# Altium schematic sheet LO.SchDoc
size A; SheetNumber: 4; SheetTotal: 11
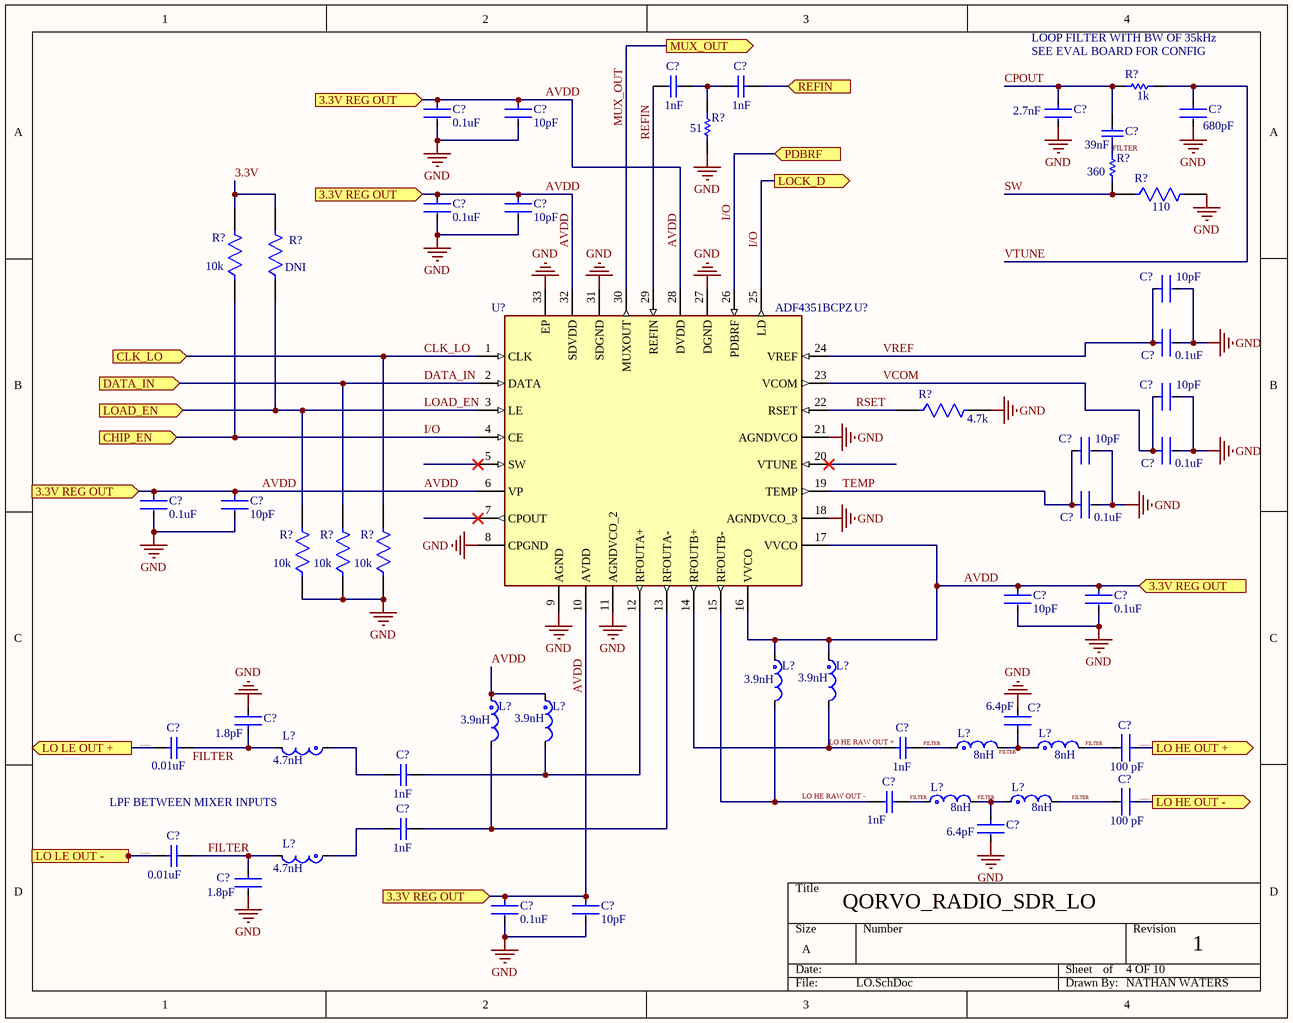
[diagram p0: LO.SchDoc]

## Parts
(Parts that share a designator on the sheet are numbered #1, #2 ... from top to bottom, then left to right.)
C?#1  Capacitance: 1nF  [CAPC2013X145X48LL20T23]  (hidden comment: VJ0805D102KXAAJ)
C?#2  Capacitance: 1nF  [CAPC2013X145X48LL20T23]  (hidden comment: VJ0805D102KXAAJ)
C?#3  Capacitance: 0.1uF  [FP-GRM155-0_05-MFG]  (hidden comment: GRM155R71C104KA88J)
C?#4  Capacitance: 10pF  [FP-GJM155-0_05-IPC_A]  (hidden comment: GJM1555C1H100JB01D)
C?#5  Capacitance: 2.7nF  [FP-GRM033-0_03-MFG]  (hidden comment: GRM033R71C272KA88D)
C?#6  Capacitance: 680pF  [FP-GCM155-0_05-IPC_A]  (hidden comment: GCM1555C1H681JA16D)
C?#7  INDUCTANCE: 39nF  [CAPC1005X55X25ML05T10]  (hidden comment: GRM155R71C393KA01D)
C?#8  Capacitance: 0.1uF  [FP-GRM155-0_05-MFG]  (hidden comment: GRM155R71C104KA88J)
C?#9  Capacitance: 10pF  [FP-GJM155-0_05-IPC_A]  (hidden comment: GJM1555C1H100JB01D)
C?#10  Capacitance: 10pF  [FP-GJM155-0_05-IPC_A]  (hidden comment: GJM1555C1H100JB01D)
C?#11  Capacitance: 0.1uF  [FP-GRM155-0_05-MFG]  (hidden comment: GRM155R71C104KA88J)
C?#12  Capacitance: 10pF  [FP-GJM155-0_05-IPC_A]  (hidden comment: GJM1555C1H100JB01D)
C?#13  Capacitance: 10pF  [FP-GJM155-0_05-IPC_A]  (hidden comment: GJM1555C1H100JB01D)
C?#14  Capacitance: 0.1uF  [FP-GRM155-0_05-MFG]  (hidden comment: GRM155R71C104KA88J)
C?#15  Capacitance: 0.1uF  [FP-GRM155-0_05-MFG]  (hidden comment: GRM155R71C104KA88J)
C?#16  Capacitance: 10pF  [FP-GJM155-0_05-IPC_A]  (hidden comment: GJM1555C1H100JB01D)
C?#17  Capacitance: 0.1uF  [FP-GRM155-0_05-MFG]  (hidden comment: GRM155R71C104KA88J)
C?#18  Capacitance: 10pF  [FP-GJM155-0_05-IPC_A]  (hidden comment: GJM1555C1H100JB01D)
C?#19  Capacitance: 0.1uF  [FP-GRM155-0_05-MFG]  (hidden comment: GRM155R71C104KA88J)
C?#20  Capacitance: 1.8pF  [FP-GJM155-0_05-MFG]  (hidden comment: GJM1555C1H1R8CB01D)
C?#21  CAPACITANCE: 1nF  [CAPC2013X145X48LL20T23]  (hidden comment: VJ0805D102KXAAJ)
C?#22  Capacitance: 6.4pF  [FP-GJM155-0_05-IPC_C]  (hidden comment: GJM1555C1H6R4BB01D)
C?#23  Capacitance: 0.01uF  [CAPC1005X55X25LL05T10]  (hidden comment: GRM155R71C103KA01D)
C?#24  value 100 pF  [FP-CBR04C-MFG]  (hidden comment: CBR04C101F3GAC)
C?#25  CAPACITANCE: 1nF  [CAPC2013X145X48LL20T23]  (hidden comment: VJ0805D102KXAAJ)
C?#26  CAPACITANCE: 1nF  [CAPC2013X145X48LL20T23]  (hidden comment: VJ0805D102KXAAJ)
C?#27  value 100 pF  [FP-CBR04C-MFG]  (hidden comment: CBR04C101F3GAC)
C?#28  CAPACITANCE: 1nF  [CAPC2013X145X48LL20T23]  (hidden comment: VJ0805D102KXAAJ)
C?#29  Capacitance: 6.4pF  [FP-GJM155-0_05-IPC_C]  (hidden comment: GJM1555C1H6R4BB01D)
C?#30  Capacitance: 0.01uF  [CAPC1005X55X25LL05T10]  (hidden comment: GRM155R71C103KA01D)
C?#31  Capacitance: 1.8pF  [FP-GJM155-0_05-MFG]  (hidden comment: GJM1555C1H1R8CB01D)
C?#32  Capacitance: 0.1uF  [FP-GRM155-0_05-MFG]  (hidden comment: GRM155R71C104KA88J)
C?#33  Capacitance: 10pF  [FP-GJM155-0_05-IPC_A]  (hidden comment: GJM1555C1H100JB01D)
L?#1  INDUCTANCE: 3.9nH  [FP-LQG15HH_02-MFG]  (hidden comment: LQG15HN3N9B02D)
L?#2  INDUCTANCE: 3.9nH  [FP-LQG15HH_02-MFG]  (hidden comment: LQG15HN3N9B02D)
L?#3  INDUCTANCE: 3.9nH  [FP-LQG15HH_02-MFG]  (hidden comment: LQG15HN3N9B02D)
L?#4  INDUCTANCE: 3.9nH  [FP-LQG15HH_02-MFG]  (hidden comment: LQG15HN3N9B02D)
L?#5  INDUCTANCE: 4.7nH  [FP-LQG15HH_02-IPC_B]  (hidden comment: LQG15HN4N7B02D)
L?#6  INDUCTANCE: 8nH  [0402 CAP_INDUCTOR]  (hidden comment: ATFC-0402-8N0B-T)
L?#7  INDUCTANCE: 8nH  [0402 CAP_INDUCTOR]  (hidden comment: ATFC-0402-8N0B-T)
L?#8  INDUCTANCE: 8nH  [0402 CAP_INDUCTOR]  (hidden comment: ATFC-0402-8N0B-T)
L?#9  INDUCTANCE: 8nH  [0402 CAP_INDUCTOR]  (hidden comment: ATFC-0402-8N0B-T)
L?#10  INDUCTANCE: 4.7nH  [FP-LQG15HH_02-IPC_B]  (hidden comment: LQG15HN4N7B02D)
R?#1  RESISTANCE: 1k  [RESC1005X40X25LL05T10]  (hidden comment: RC0402JR-071KL)
R?#2  Resistance: 51  [RESC1005X40X25NL05T05]  (hidden comment: CRCW040251R0FKED)
R?#3  Resistance: 360  [RESC1005X40X25LL05T05]  (hidden comment: RMCF1206JT360R)
R?#4  Resistance: 110  [FP-CRCW0402-e3-IPC_A]  (hidden comment: CRCW0402110RFKED)
R?#5  Resistance: 10k  [FP-CRCW0402-C-e3-IPC_C]  (hidden comment: CRCW040210K0FKEDC)
R?#6  CRCW040210K0FKEDC  [FP-CRCW0402-C-e3-IPC_C]  (value not drawn)
R?#7  Resistance: 4.7k  [FP-CRCW0402-e3-IPC_B]  (hidden comment: CRCW04024K70FKED)
R?#8  Resistance: 10k  [FP-CRCW0402-C-e3-IPC_C]  (hidden comment: CRCW040210K0FKEDC)
R?#9  Resistance: 10k  [FP-CRCW0402-C-e3-IPC_C]  (hidden comment: CRCW040210K0FKEDC)
R?#10  Resistance: 10k  [FP-CRCW0402-C-e3-IPC_C]  (hidden comment: CRCW040210K0FKEDC)
U?  ADF4351BCPZ  [ADF4351BCPZ]  (value not drawn)

## Ports
3.3V REG OUT (in, see 3.3v REG[2B], LO[1A], LO[1B], LO[2D]), 3.3V REG OUT (in, see 3.3v REG[2B], LO[1A], LO[1B], LO[2D], LO[4C]), 3.3V REG OUT (in, see 3.3v REG[2B], LO[1A], LO[1B], LO[4C]), 3.3V REG OUT (in, see 3.3v REG[2B], LO[1A], LO[2D], LO[4C]), CHIP_EN (in, see 0.9V REG[3B], 3.3v REG[3B], HE Mixer[2C], LE Mixer[2C]), CLK_LO (in), DATA_IN (in), LO HE OUT + (out), LO HE OUT - (out), LO LE OUT + (out, see HE Mixer[3B], LE Mixer[3B]), LO LE OUT - (out, see HE Mixer[3B], LE Mixer[3B]), LOAD_EN (in), LOCK_D (out), MUX_OUT (out), PDBRF (in), REFIN (in)

## Nets
GND: C?#3.2 C?#4.2 C?#5.2 C?#6.2 C?#8.2 C?#9.2 C?#10.2 C?#11.2 C?#12.2 C?#13.2 C?#14.2 C?#15.2 C?#16.2 C?#17.2 C?#18.2 C?#19.2 C?#20.2 C?#22.2 C?#29.2 C?#31.2 C?#32.2 C?#33.2 R?#2.2 R?#4.2 R?#7.2 R?#8.1 R?#9.1 R?#10.1 U?.8(CPGND) U?.9(AGND) U?.11(AGNDVCO_2) U?.18(AGNDVCO_3) U?.21(AGNDVCO) U?.27(DGND) U?.31(SDGND) U?.33(EP)
3.3V: R?#5.2 R?#6.2
AVDD: C?#3.1 C?#4.1 C?#8.1 C?#9.1 C?#15.1 C?#16.1 C?#18.1 C?#19.1 C?#32.1 C?#33.1 L?#1.1 L?#2.1 L?#3.1 L?#4.1 U?.6(VP) U?.10(AVDD) U?.16(VVCO) U?.17(VVCO) U?.28(DVDD) U?.32(SDVDD) ; port 3.3V REG OUT
CLK_LO: R?#10.2 U?.1(CLK) ; port CLK_LO
CPOUT: C?#5.1 C?#7.1 R?#1.1
DATA_IN: R?#9.2 U?.2(DATA) ; port DATA_IN
FILTER: C?#7.2 C?#20.1 C?#21.2 C?#22.1 C?#23.2 C?#24.1 C?#26.2 C?#27.1 C?#29.1 C?#30.2 C?#31.1 L?#5.2 L?#6.1 L?#6.2 L?#7.1 L?#7.2 L?#8.1 L?#8.2 L?#9.1 L?#9.2 L?#10.2 R?#3.2
I/O: R?#5.1 U?.4(CE) U?.25(LD) U?.26(PDBRF) ; port CHIP_EN, port LOCK_D, port PDBRF
LO HE OUT +: C?#24.2 ; port LO HE OUT +
LO HE OUT -: C?#27.2 ; port LO HE OUT -
LO HE RAW OUT +: C?#21.1 L?#2.2 U?.14(RFOUTB+)
LO HE RAW OUT -: C?#26.1 L?#1.2 U?.15(RFOUTB-)
LO LE OUT +: C?#23.1 ; port LO LE OUT +
LO LE OUT -: C?#30.1 ; port LO LE OUT -
LOAD_EN: R?#6.1 R?#8.2 U?.3(LE) ; port LOAD_EN
MUX_OUT: U?.30(MUXOUT) ; port MUX_OUT
REFIN: C?#1.1 U?.29(REFIN)
REFIN: C?#2.2 ; port REFIN  [a separate net that carries the same name]
RSET: R?#7.1 U?.22(RSET)
SW: R?#3.1 R?#4.1
TEMP: C?#13.1 C?#17.1 U?.19(TEMP)
VCOM: C?#12.1 C?#14.1 U?.23(VCOM)
VREF: C?#10.1 C?#11.1 U?.24(VREF)
VTUNE: C?#6.1 R?#1.2
NetC?#1_2: C?#1.2 C?#2.1 R?#2.1
NetC?#25_1: C?#25.1 L?#5.1
NetC?#25_2: C?#25.2 L?#4.2 U?.12(RFOUTA+)
NetC?#28_1: C?#28.1 L?#10.1
NetC?#28_2: C?#28.2 L?#3.2 U?.13(RFOUTA-)

Not connected (* = marked no-connect by the designer): U? 5(SW)* 7(CPOUT)* 20(VTUNE)*

## Notes on the sheet
- LOOP FILTER WITH BW OF 35kHz
- (near R?#1) SEE EVAL BOARD FOR CONFIG
- (near C?#30) LPF BETWEEN MIXER INPUTS
- QORVO_RADIO_SDR_LO
- 4 OF 10
- 1
- NATHAN WATERS

## Library data of the parts
C?#1 C?#2 C?#21 C?#25 C?#26 C?#28 = CMP-2007-03135-1: Manufacturer: Vitramon; Part Number: VJ0805D102KXAAJ
C?#3 C?#8 C?#11 C?#14 C?#15 C?#17 C?#19 C?#32 = CMP-2008-03928-2: NexarPartId: 9223238; Manufacturer Lifecycle Status: NRND; Voltage: 16V; Tolerance: 10%; Dielectric: X7R; Material: Ceramic; Schedule B: 8532240020, 8532240020; Mount: Surface Mount; Case/Package: 0402; Case Code (Imperial): 0402; Min Operating Temperature: -55°C; Length: 1mm; Voltage Rating (DC): 16V; Depth: 500µm; Lead Free: Lead Free; Max Operating Temperature: 125°C; Case Code (Metric): 1005; Radiation Hardening: No; Height: 550µm; Voltage Rating: 16V; Packaging: Cut Tape; RoHS: Compliant; Width: 500µm; Number of Pins: 2; REACH SVHC: No SVHC; Termination: SMD/SMT; Thickness: 500µm
C?#4 C?#9 C?#10 C?#12 C?#13 C?#16 C?#18 C?#33 = CMP-2008-03797-2: Multi-Layer Ceramic Capacitor 10pF C0G  ±5% 0402 Paper T/R; Voltage Rating (DC): 50V; Mount: Surface Mount; Width: 0.02inch; Height: 0.5mm; Termination: SMD/SMT; Packaging: Tape and Reel; Case Code (Metric): 1005; Depth: 0.5mm; Min Operating Temperature: -55°C; Case/Package: 0402; Voltage Rating: 50V; Tolerance: 5%; Lead Free: Lead Free; Package Quantity: 1; Case Code (Imperial): 0402; Radiation Hardening: No; Length: 1mm; Voltage: 50V; Dielectric: C0G; Thickness: 0.022inch; Max Operating Temperature: 125°C
C?#5 = CMP-2010-01696-2: Chip Multilayer Ceramic Capacitors for General Purpose, 0201, 2700pF, X7R, 15%, 10%, 16V; Packaging: Tape and Reel; Height: 0.3mm; Voltage Rating (DC): 16V; Tolerance: 10%; Case/Package: 0201; Voltage Rating: 16V; Case Code (Metric): 0603; Max Operating Temperature: 125°C; Depth: 0.3mm; Package Quantity: 15000; Termination: SMD/SMT; Dielectric: X7R; Case Code (Imperial): 0201; Thickness: 0.013inch; Mount: Surface Mount; Length: 0.6mm; Radiation Hardening: No; Width: 0.3mm; Min Operating Temperature: -55°C
C?#6 = CMP-06035-011473-1: Ceramic Capacitor for Automotive 680pF ±5% 50VDC C0G 0402 Paper T/R; Voltage Rating: 50V; Min Operating Temperature: -55°C; Case Code (Imperial): 0402; Case Code (Metric): 1005; Tolerance: 5%; Mount: Surface Mount; Lead Free: Lead Free; Ratings: AEC-Q200; Case/Package: 0402; Max Operating Temperature: 125°C; Packaging: Tape and Reel
C?#7 = CMP-2008-04607-1: Manufacturer: Murata; Part Number: GRM155R71C393KA01D
C?#20 C?#31 = CMP-2008-03826-2: Multi-Layer Ceramic Capacitor 1.8pF C0G  ±0.25pF 0402 Paper T/R; Voltage Rating: 50V; Thickness: 0.022inch; Packaging: Tape and Reel; Mount: Surface Mount; Width: 0.02inch; Lead Free: Lead Free; Case Code (Imperial): 0402; Termination: SMD/SMT; Package Quantity: 1; Depth: 0.5mm; Dielectric: C0G; Case/Package: 0402; Voltage: 50V; Radiation Hardening: No; Min Operating Temperature: -55°C; Length: 1mm; Case Code (Metric): 1005; Voltage Rating (DC): 50V; Height: 0.5mm; Max Operating Temperature: 125°C
C?#22 C?#29 = CMP-06035-006752-1: Multi-Layer Ceramic Capacitor 6.4pF C0G  ±0.1pF 0402 Paper T/R; Voltage Rating: 50V; Height: 0.5mm; Case Code (Metric): 1005; Dielectric: C0G; Max Operating Temperature: 125°C; Mount: Surface Mount; Thickness: 0.022inch; Depth: 0.5mm; Width: 0.02inch; Radiation Hardening: No; Package Quantity: 10000; Case/Package: 0402; Packaging: Tape and Reel; Length: 0.039inch; Voltage Rating (DC): 50V; Termination: SMD/SMT; Case Code (Imperial): 0402; Min Operating Temperature: -55°C
C?#23 C?#30 = CMP-2000-06332-1: Chip Capacitor, 10 nF, 16 V, 10%, -55 to 125 degC, 0402 (1005 Metric), RoHS, Tape and Reel; Manufacturer: Murata; Rated Voltage: 16V; Dielectric: X7R; Manufacturer URL: http://www.murata.com/; Package Description: 2-Pin Surface Mount Device, Body 1 x 0.5 mm; Case Size/Dimension: 0402; Tolerance (%): ±10%; Datasheet Version: 06/2016; Package Reference: 0402; Mounting Technology: SurfaceMount; Datasheet URL: http://psearch.en.murata.com/capacitor/product/GRM155R71C103KA01%23.pdf
C?#24 C?#27 = CMP-03020-015868-1: CAP CER 100PF 25V C0G/NP0 0402; Manufacturer: KEMET; Temperature Coefficient: 30ppm/°C; Temperature Characteristic: C0G; Material: Ceramic; Tolerance: 0.01; Device Class L2: Capacitors; Temperature Range Low: -55°C; Device Class L3: Ceramic Capacitors; Category: Cap; Height: 0.55mm; Capacitance: 100 pF; Digikey Description: CAP CER 100PF 25V C0G/NP0 0402; Device Class L1: Passive Components; Manufacturer Part Number: CBR04C101F3GAC; Temperature Range High: +125°C; Package: CBR04C; Mouser Description: Multilayer Ceramic Capacitors MLCC - SMD/SMT 25volts 100pF C0G 0402 1% Tol RF; RoHS: TRUE; Temperature: -55°C to +125°C; Octopart: https://octopart.com/cbr04c101f3gac-kemet-30609226; Ipc Land Pattern Name: CAPC10050X50; Lead Free: Yes; ComponentLink2URL: https://content.kemet.com/datasheets/KEM_C1030_CBR_SMD.pdf; Voltage Rating: 25 V; Automotive: No; ComponentLink2Description: Datasheet
L?#1-L?#4 = CMP-06042-007943-1: Multilayer type RF Inductor 3.9nH ±0.1nH 0.13Ω 700mA 0402
L?#5 L?#10 = CMP-06042-002865-1: Multilayer type RF Inductor 4.7nH ±0.1nH 0.16Ω 700mA 0402
L?#6-L?#9 = 0402_IND: 8 nH Unshielded Thin Film Inductor 220 mA 1.25Ohm Max 0402 (1005 Metric)
R?#1 = CMP-2002-07941-1: Manufacturer: Yageo / Phycomp; Part Number: RC0402JR-071KL
R?#2 = CMP-2002-00082-1: Manufacturer: Vishay Dale; Part Number: CRCW040251R0FKED
R?#3 = RES: 360 Ohms ±5% 0.25W, 1/4W Chip Resistor 1206 (3216 Metric) Automotive AEC-Q200 Thick Film; Manufacturer: Panasonic; Part Number: ERJ-2RKF3600X
R?#4 = CMP-2002-08150-2: RES Thick Film, 110Ω, 1%, 0.063W, 100ppm/°C, 0402; Voltage Rating (DC): 50V; Max Power Dissipation: 63mW; Radiation Hardening: No; Resistor Type: Thick Film; Termination: SMD/SMT; Tolerance: 1%; Number of Pins: 2; Package Quantity: 10000; Length: 1mm; RoHS Compliant: Yes; Lead Free: Lead Free; Case Code (Imperial): 0402; Number of Terminations: 2; Technology: THICK FILM; Width: 0.5mm; Case/Package: 0402; Depth: 0.5mm; Max Operating Temperature: 155°C; Features: Automotive AEC-Q200; Size Code: 0402; Temperature Coefficient: 100ppm/°C; Weight: 2.3E-05oz; Contact Plating: Tin; Min Operating Temperature: -55°C; Height: 0.35mm; Power Rating: 63mW; Packaging: Tape and Reel; Case Code (Metric): 1005; Resistance Tolerance: 1%; Military Standard: Not; Voltage Rating: 50V; Series: CRCW; Construction: Rectangular
R?#5 R?#8-R?#10 = CMP-02407-012085-1: RES 10K OHM 1% 1/16W 0402; Temperature Coefficient: 100ppm/°C; Power Rating: 62.5mW; Lead Free: Lead Free; Max Operating Temperature: 155°C; RoHS Compliant: Yes; Mount: Surface Mount; Min Operating Temperature: -55°C; Termination: Wraparound; Length: 1mm; Resistor Type: Thick Film; Contact Plating: Tin; Tolerance: 1%; Case/Package: Molded
R?#6 = CMP-02407-012085-1: DNI; Temperature Coefficient: 100ppm/°C; Power Rating: 62.5mW; Tolerance: 1%; Lead Free: Lead Free; Max Operating Temperature: 155°C; RoHS Compliant: Yes; Mount: Surface Mount; Min Operating Temperature: -55°C; Termination: Wraparound; Length: 1mm; Resistor Type: Thick Film; Contact Plating: Tin; Resistance: DNI; Case/Package: Molded
R?#7 = CMP-2002-00051-3: RES Thick Film, 4.7kΩ, 1%, 0.063W, 100ppm/°C, 0402; Voltage Rating (DC): 50V; Power Rating: 63mW; Termination: SMD/SMT; Military Standard: Not; Length: 1mm; Radiation Hardening: No; Max Operating Temperature: 155°C; Min Operating Temperature: -55°C; Package Quantity: 10; Width: 0.5mm; Case Code (Imperial): 0402; Number of Terminations: 2; Max Power Dissipation: 63mW; Tolerance: 1%; Features: Automotive AEC-Q200; Composition: Thick Film; Depth: 0.5mm; Mount: Surface Mount; Weight: 2.3E-05oz; Lead Free: Lead Free; Case/Package: 0402; Height: 0.35mm; Packaging: Tape and Reel; Temperature Coefficient: 100ppm/°C; Case Code (Metric): 1005; Voltage Rating: 50V; Contact Plating: Tin
U? = ADF4351BCPZ: LO; Manufacturer_Name: Analog Devices; Datasheet Link: https://www.analog.com/media/en/technical-documentation/data-sheets/ADF4351.pdf; Manufacturer_Part_Number: ADF4351BCPZ